# EAGLE design Bistable Multivibrator (EAGLE 9.0.1)
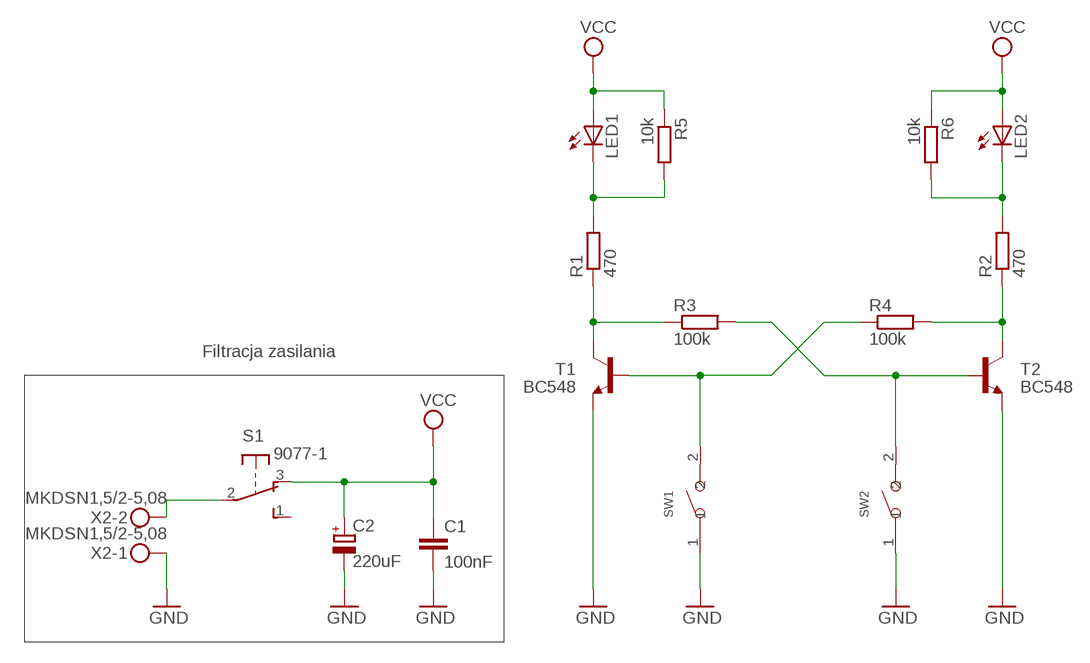
[diagram p0: schematic, sheet 1]

## Parts
C1  100nF  C-EU025-024X044  [C025-024X044]
C2  220uF  CPOL-EUE3.5-8  [E3,5-8]
LED1  LED5MM  [LED5MM]
LED2  LED5MM  [LED5MM]
R1  470  R-EU_0204/7  [0204/7]
R2  470  R-EU_0204/7  [0204/7]
R3  100k  R-EU_0204/7  [0204/7]
R4  100k  R-EU_0204/7  [0204/7]
R5  10k  R-EU_0204/7  [0204/7]
R6  10k  R-EU_0204/7  [0204/7]
S1  9077-1  [9077-1]
SW1  DIP-BUTTON(2P-6.0X3.0X4.3MM)-TS-1101F  [SW2-5.0-6.0X3.0X4.3MM]
SW2  DIP-BUTTON(2P-6.0X3.0X4.3MM)-TS-1101F  [SW2-5.0-6.0X3.0X4.3MM]
T1  BC548  BC547B-NPN-TO92-CBE  [TO92-CBE]
T2  BC548  BC547B-NPN-TO92-CBE  [TO92-CBE]
X2  MKDSN1,5/2-5,08  [MKDSN1,5/2-5,08]

## Nets
GND: C1.2 C2.- SW1.1 SW2.1 T1.E T2.E X2.1
N$1: LED1.K(C) R1.2 R5.2
N$2: R1.1 R3.1 T1.C
N$3: S1.2(P) X2.2
N$4: R4.1 SW1.2 T1.B
N$5: R3.2 SW2.2 T2.B
N$7: LED2.K(C) R2.2 R6.2
N$11: R2.1 R4.2 T2.C
VCC: C1.1 C2.+ LED1.A LED2.A R5.1 R6.1 S1.3(O)
Unconnected: S1.1(S)

## Notes on the sheet
- Filtracja zasilania

## Library data of the parts
C1 = rcl:C-EU: CAPACITOR, European symbol; SPICEPREFIX: C
C2 = rcl:CPOL-EU: POLARIZED CAPACITOR, European symbol; SPICEPREFIX: C
LED1 LED2 = led:LED: LED OSRAM: - CHIPLED LG R971, LG N971, LY N971, LG Q971, LY Q971, LO R971, LY R971 LH N974, LH R974 LS Q976, LO Q976, LY Q976 LO Q996 - Hyper CHIPLED LW Q18S LB Q993, LB Q99A, LB R99A - SideLED LS A670, LO A670, LY A670, LG A670, LP A670 LB A673, LV A673, LT A673, LW A673 LH A674 LY A675 LS A676, LA A676, LO A676, LY A676, LW A676 LS A679, LY A679, LG A679 - Hyper Micro SIDELED® LS Y876, LA Y876, LO Y876, LY Y876 LT Y87S - SmartLED LW L88C, LW L88S LB L89C, LB L89S, LG L890 LS L89K, LO L89K, LY L89K LS L896, LA L896, LO L896, LY L896 - TOPLED LS T670, LO T670, LY T670, LG T670, LP T670 LSG T670, LSP T670, LSY T670, LOP T670, LYG T670 LG T671, LOG T671, LSG T671 LB T673, LV T673, LT T673, LW T673 LH T674 LS T676, LA T676, LO T676, LY T676, LB T676, LH T676, LSB T676, LW T676 LB T67C, LV T67C, LT T67C, LS T67K, LO T67K, LY T67K, LW E67C LS E67B, LA E67B, LO E67B, LY E67B, LB E67C, LV E67C, LT E67C LW T67C LS T679, LY T679, LG T679 LS T770, LO T770, LY T770, LG T770, LP T770 LB T773, LV T773, LT T773, LW T773 LH T774 LS E675, LA E675, LY E675, LS T675 LS T776, LA T776, LO T776, LY T776, LB T776 LHGB T686 LT T68C, LB T68C - Hyper Mini TOPLED® LB M676 - Mini TOPLED Santana® LG M470 LS M47K, LO M47K, LY M47K Source: http://www.osram.convergy.de LUXEON: - LUMILED® LXK2-PW12-R00, LXK2-PW12-S00, LXK2-PW14-U00, LXK2-PW14-V00 LXK2-PM12-R00, LXK2-PM12-S00, LXK2-PM14-U00 LXK2-PE12-Q00, LXK2-PE12-R00, LXK2-PE12-S00, LXK2-PE14-T00, LXK2-PE14-U00 LXK2-PB12-K00, LXK2-PB12-L00, LXK2-PB12-M00, LXK2-PB14-N00, LXK2-PB14-P00, LXK2-PB14-Q00 LXK2-PR12-L00, LXK2-PR12-M00, LXK2-PR14-Q00, LXK2-PR14-R00 LXK2-PD12-Q00, LXK2-PD12-R00, LXK2-PD12-S00 LXK2-PH12-R00, LXK2-PH12-S00 LXK2-PL12-P00, LXK2-PL12-Q00, LXK2-PL12-R00 Source: www.luxeon.com KINGBRIGHT: KA-3528ASYC Source: www.kingbright.com
R1-R6 = rcl:R-EU_: RESISTOR, European symbol; SPICEPREFIX: R
S1 = switch-misc:9077-1: MARQUARDT SWITCH 9077.0100 Distributor: Buerklin <https://www.buerklin.com/default.asp?event=ShowArtikel%2812G2820%29&l=d&jump=ArtNr_12G2820>
SW1 SW2 = Seeed-OPL-Switch:DIP-BUTTON(2P-6.0X3.0X4.3MM): 311020025
T1 T2 = transistor:*-NPN-: NPN Transistror BF959 corrected 2008.03.06
X2 = con-phoenix-508:MKDSN1,5/2-5,08: MKDSN 1,5/ 2-5,08 Printklemme Nennstrom: 13,5 A Nennspannung: 250 V Rastermaß: 5,08 mm Polzahl: 2 Anschlussart: Schraubanschluss Montage: Löten Anschlussrichtung Leiter/Platine: 0 ° Artikelnummer: 1729128 Source: http://eshop.phoenixcontact.com .. 1729128.pdf

## Board
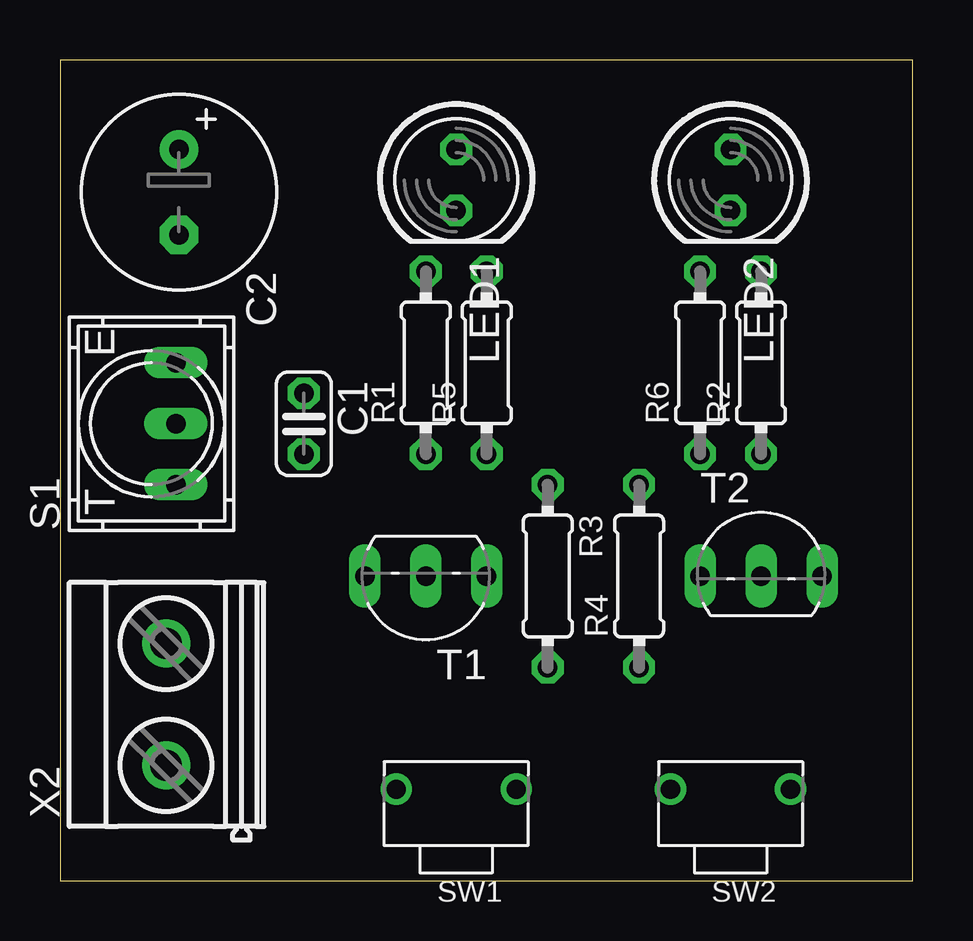
[diagram p1: board, top side]
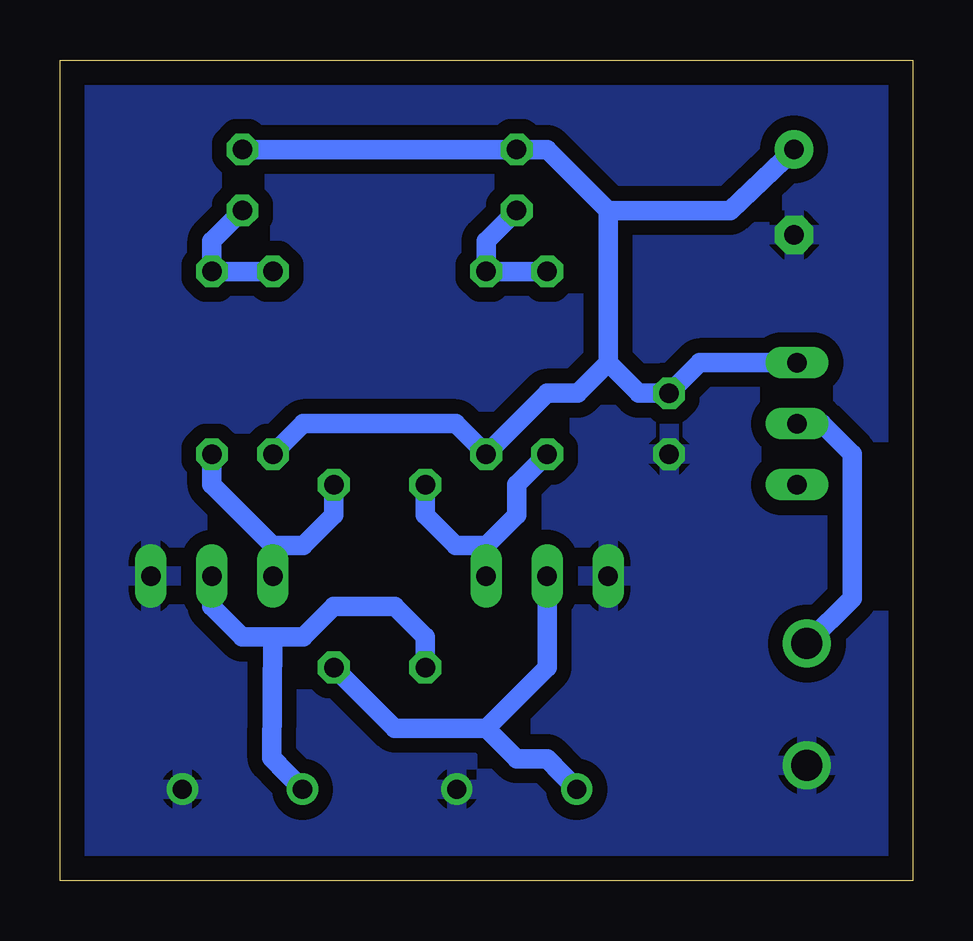
[diagram p2: board, bottom side, seen from below]

Size 35.54 x 34.21 mm. Coordinates in mm from the lower left corner, seen from the top.
Outline: 0,0 35.54,0 35.54,34.21 0,34.21 0,0
Copper layers (1*16): Top 0.035mm / dielectric 1.5mm / Bottom 0.035mm
Design rules "default": minimum track width 6mil, minimum drill 0.35mm, track to track 6mil, track to pad 6mil, pad to pad 6mil, via to via 6mil, smd to smd 6mil, copper to edge 40mil, drill to drill 6mil, minimum pad ring 10mil, minimum via ring 8mil, stop-mask expansion 4mil, vias tented up to drill 0mil, thermal gap 10mil

### Footprints (pad centres in the part's own frame; a part is rotated, then mirrored left to right if it is on the bottom)
C025-024X044 = drill 0.813 octagon: 1 -1.27,0; 2 1.27,0
E3,5-8 = drill 0.813 pad 1.6: + -1.778,0 | drill 0.813 pad 1.6 octagon: - 1.778,0
LED5MM = drill 0.813 octagon: A -1.27,0; K 1.27,0
0204/7 = drill 0.813 octagon: 1 -3.81,0; 2 3.81,0
9077-1 = drill 0.813 long: 1 -2.54,-1.016; 2 0,-1.016; 3 2.54,-1.016
SW2-5.0-6.0X3.0X4.3MM = drill 0.8 pad 1.27: 1 -2.5,0; 2 2.5,0
TO92-CBE = drill 0.813 long: B 0,0; C -2.54,0; E 2.54,0
MKDSN1,5/2-5,08 = drill 1.3 pad 2: 1 -2.561,0.025; 2 2.519,0.025

### Placement (x,y rotation side)
C1  10.16,19.05 270 top
C2  4.95,28.7 270 top
LED1  16.51,29.21 270 top
LED2  27.94,29.21 270 top
R1  15.24,21.59 90 top
R2  29.21,21.59 90 top
R3  20.32,12.7 270 top
R4  24.13,12.7 90 top
R5  17.78,21.59 90 top
R6  26.67,21.59 90 top
S1  3.81,19.05 90 top
SW1  16.51,3.81 180 top
SW2  27.94,3.81 180 top
T1  15.24,12.7 180 top
T2  29.21,12.7 0 top
X2  4.45,7.37 90 top

### Tracks (layer width: path | path; a pad name or v marks a point on that pad's centre or on a via)
GND
  pour Bottom (isolate 0.61): -1.27,35.56 -1.27,-1.27 35.56,-1.27 35.56,35.56
N$1
  Bottom 0.813: R1.2 R5.2 17.78,26.67 LED1.K
N$2
  Bottom 0.813: R1.1 16.51,16.51 16.51,15.24 17.78,13.97 | 17.78,13.97 T1.C | 17.78,13.97 19.05,13.97 20.32,15.24 R3.1
N$3
  Bottom 0.813: X2.2 2.54,11.77 2.54,17.78 3.81,19.05 S1.2
N$4
  Bottom 0.813: R4.1 21.59,6.35 17.78,6.35 | SW1.2 15.24,5.08 16.51,5.08 17.78,6.35 | T1.B 15.24,8.89 17.78,6.35
N$5
  Bottom 0.813: SW2.2 26.71,5.12 26.67,10.16 | R3.2 20.32,10.16 21.59,11.43 24.13,11.43 25.4,10.16 26.67,10.16 | T2.B 29.21,11.43 27.94,10.16 26.67,10.16
N$7
  Bottom 0.813: R6.2 R2.2 29.21,26.67 LED2.K
N$11
  Bottom 0.813: R4.2 24.13,15.24 25.4,13.97 26.67,13.97 | 26.67,13.97 T2.C | R2.1 29.21,16.51 26.67,13.97
VCC
  Bottom 0.813: 12.7,27.94 15.24,30.48 LED1.A LED2.A | R6.1 25.4,19.05 19.05,19.05 R5.1 15.24,20.32 13.97,20.32 12.7,21.59 | 12.7,27.94 7.62,27.94 C2.+ | S1.3 8.89,21.59 C1.1 11.43,20.32 12.7,21.59 | 12.7,21.59 12.7,27.94